# Altium project ChiptunePlayer-2.22-MainBoard v2.0.PrjPCB
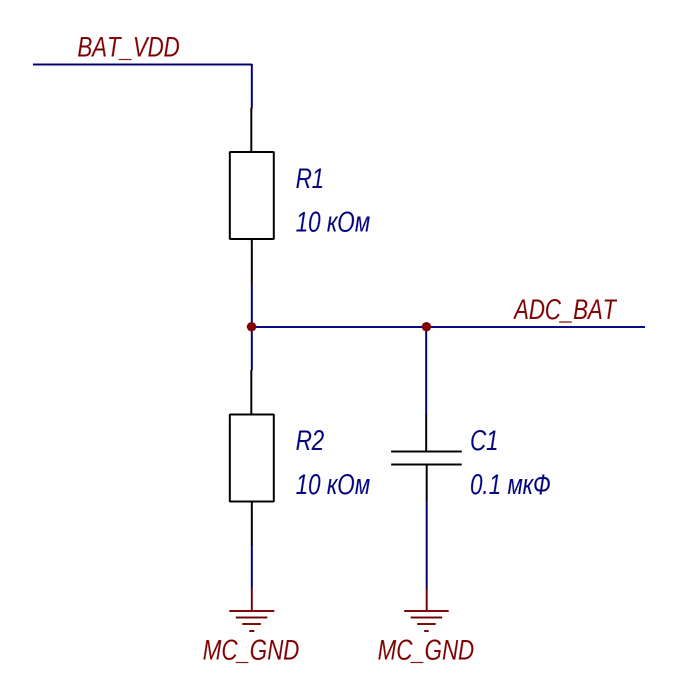
[diagram p0: BatteryCheck.SchDoc]
10 sheets, 91 parts. Net scope: global (net labels, ports and power ports of the same name join across sheets).
Board file: main.PcbDoc
Sheets:
  BatteryCheck.SchDoc
  Connectors.SchDoc
  ControlledCharger.SchDoc
  Microcontroller.SchDoc
  PowerManagement.SchDoc
  DcDc3V3.SchDoc
  DcDc5V.SchDoc
  MicroSdCard.SchDoc
  KeyBoard.SchDoc
  Lcd.SchDoc

## Sheet BatteryCheck.SchDoc
size 420 x 297 mm; DocumentNumber: BatteryCheck

### Parts
C1  0.1 мкФ  [C 0805]
R1  10 кОм  [RES 0402]
R2  10 кОм  [RES 0402]

### Nets
MC_GND: C1.2 R2.1
ADC_BAT: C1.1 R1.1 R2.2
BAT_VDD: R1.2

### Notes on the sheet
- Подп. и дата
- Инв. № дубл.
- Взам. инв. №
- Инв. № подл.
- Лист
- Изм.
- № докум.
- Подп.
- Дата
- Копировал
- Формат А3

### Library data of the parts
C1 = CAP 0805: SMD Capacitor 0805; Manufacturer: /Укажите компанию-производителя/; Tolerance: /Укажите допуск в процентах/; Temperature coefficient: /Формат: ±? ppm/°C/; Type: Конденсатор керамический; TC: /Укажите тип диэлектрика/; Size: 0805; Temperature range: /Формат: -? ... ? °C/
R1 R2 = RES 0402

## Sheet Connectors.SchDoc
size 420 x 297 mm; DocumentNumber: Connectors
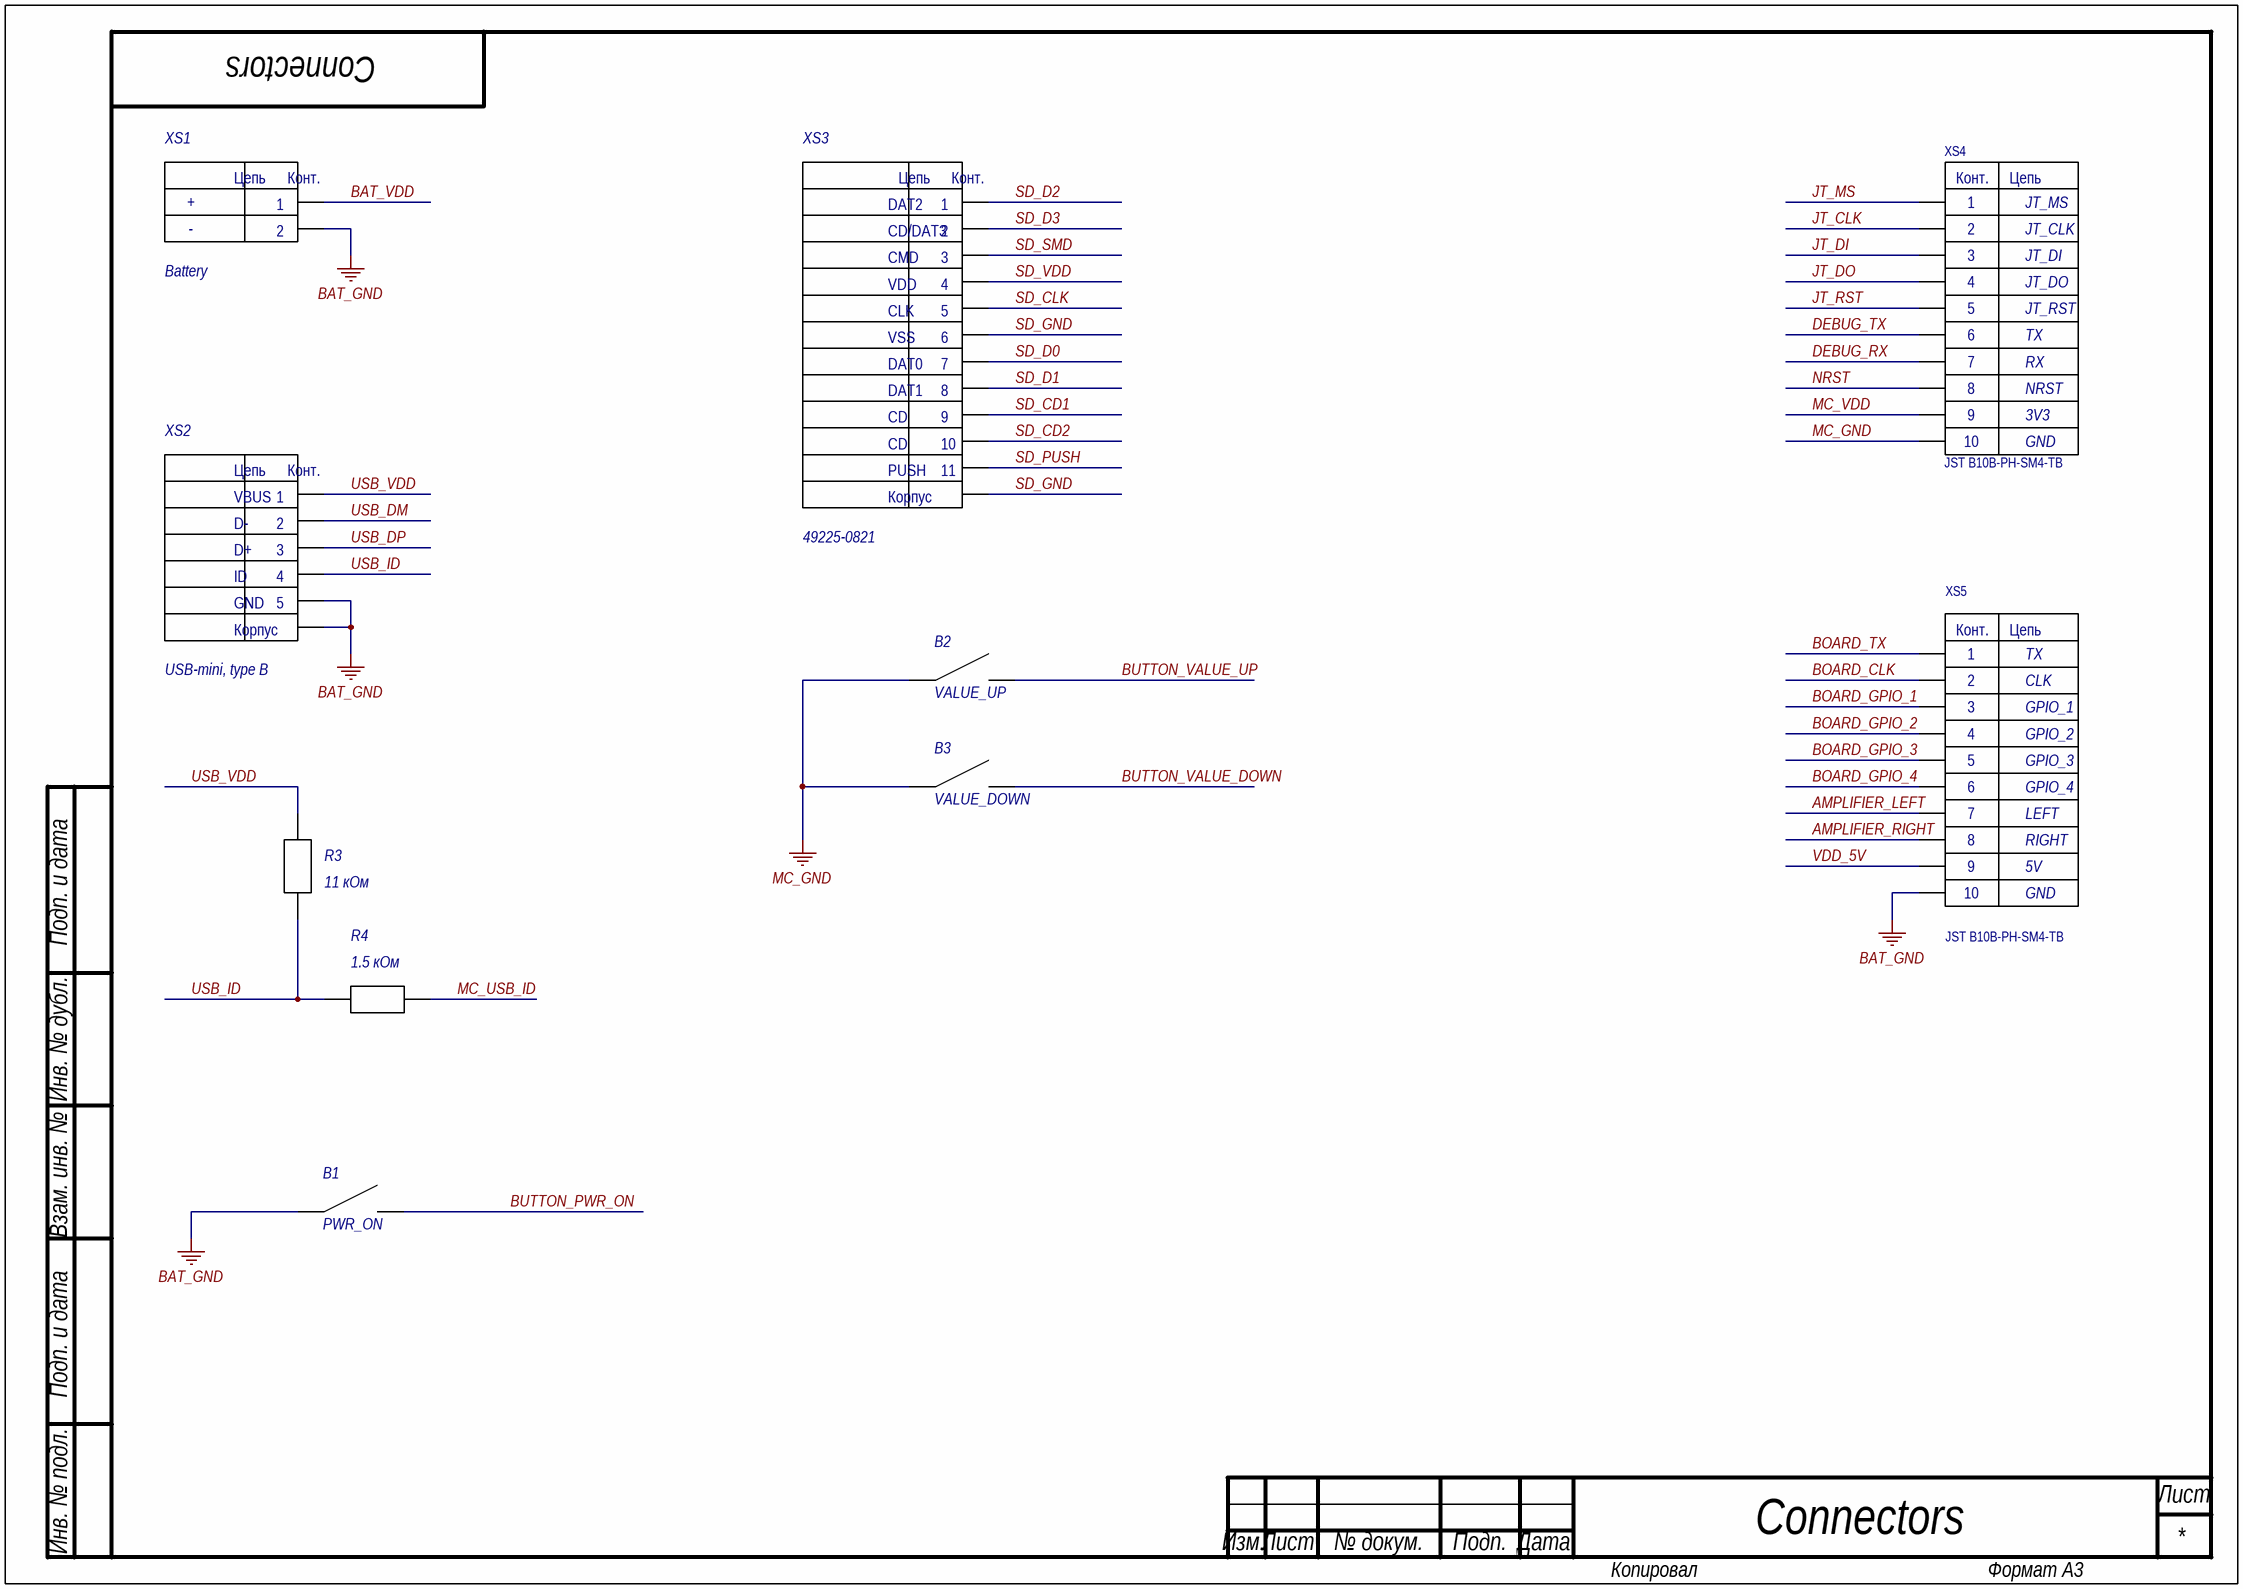
[diagram p1: Connectors.SchDoc]

### Parts
B1  PWR_ON  [TACT SKHH Horizontal Switch]
B2  VALUE_UP  [TACT SKHH Horizontal Switch]
B3  VALUE_DOWN  [TACT SKHH Horizontal Switch]
R3  11 кОм  [RES 0402]
R4  1.5 кОм  [RES 0402]
XS1  Battery  [JST B2B-PH-SM4-TB]
XS2  USB-mini, type B  [USB_mini_B]
XS3  49225-0821  [MOLEX 49225-0821]
XS4  JST B10B-PH-SM4-TB  [B10B-PH-SM4-TB]
XS5  JST B10B-PH-SM4-TB  [B10B-PH-SM4-TB]

### Nets
BAT_GND: B1.1 XS1.2 XS2.0 XS2.5(GND) XS5.10
MC_GND: B2.1 B3.1 XS4.10
MC_VDD: XS4.9
AMPLIFIER_LEFT: XS5.7
AMPLIFIER_RIGHT: XS5.8
BAT_VDD: XS1.1
BOARD_CLK: XS5.2
BOARD_GPIO_1: XS5.3
BOARD_GPIO_2: XS5.4
BOARD_GPIO_3: XS5.5
BOARD_GPIO_4: XS5.6
BOARD_TX: XS5.1
BUTTON_PWR_ON: B1.2
BUTTON_VALUE_DOWN: B3.2
BUTTON_VALUE_UP: B2.2
DEBUG_RX: XS4.7
DEBUG_TX: XS4.6
JT_CLK: XS4.2
JT_DI: XS4.3
JT_DO: XS4.4
JT_MS: XS4.1
JT_RST: XS4.5
MC_USB_ID: R4.1
NRST: XS4.8
SD_CD1: XS3.9
SD_CD2: XS3.10
SD_CLK: XS3.5
SD_D0: XS3.7
SD_D1: XS3.8
SD_D2: XS3.1
SD_D3: XS3.2
SD_GND: XS3.0 XS3.6
SD_PUSH: XS3.11
SD_SMD: XS3.3
SD_VDD: XS3.4
USB_DM: XS2.2(D-)
USB_DP: XS2.3(D+)
USB_ID: R3.1 R4.2 XS2.4(CASE)
USB_VDD: R3.2 XS2.1(VBUS)
VDD_5V: XS5.9

### Notes on the sheet
- +
- -
- JT_CLK
- JT_MS
- JT_DI
- JT_RST
- JT_DO
- TX
- NRST
- RX
- 3V3
- GND
- CLK
- GPIO_1
- GPIO_2
- GPIO_3
- GPIO_4
- LEFT
- RIGHT
- 5V
- Подп. и дата
- Инв. № дубл.
- Взам. инв. №
- Инв. № подл.
- Лист
- Изм.
- № докум.
- Подп.
- Дата
- Копировал
- Формат А3
- (in symbol 49225-0821) Цепь; Конт.; DAT2; CD/DAT3; CMD; VDD; CLK; VSS; DAT0; DAT1; CD; PUSH; Корпус
- (in symbol JST B2B-PH-SM4-TB) Цепь; Конт.
- (in symbol JST B10B-PH-SM4-TB) Конт.; Цепь
- (in symbol USB-mini_B) Цепь; Конт.; ID; Корпус

### Library data of the parts
B1-B3 = BUTTON
R3 R4 = RES 0402
XS1 = JST B2B-PH-SM4-TB
XS2 = USB-mini_B: USB-mini-B connector; Manufacturer: NONAME; Connector type: USB-mini, тип B на плату; Number of contacts: 5; Type: Разъем
XS3 = 49225-0821: MOLEX MicroSD connector; Connector type: Разъем MicroSD на плату; Number of contacts: 11; Manufacturer: Molex; Type: Разъем
XS4 XS5 = JST B10B-PH-SM4-TB: PLS connector; Manufacturer: NONAME; Connector type: Вилка на плату; Number of contacts: 10; Type: Разъем штыревой

## Sheet ControlledCharger.SchDoc
size 420 x 297 mm; DocumentNumber: ControlledCharger
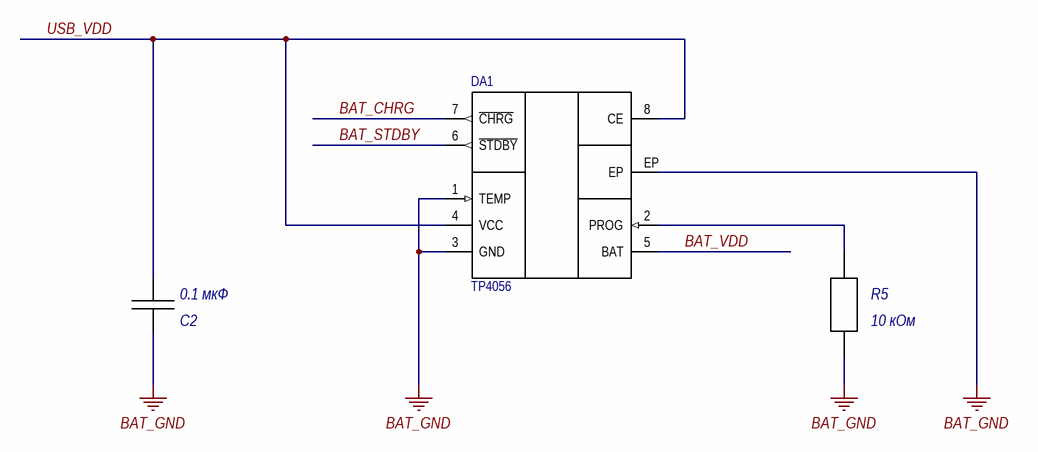
[diagram p2: ControlledCharger.SchDoc]

### Parts
C2  0.1 мкФ  [C 0805]
DA1  TP4056  [HSOP-8]
R5  10 кОм  [RES 0402]

### Nets
BAT_GND: C2.2 DA1.1(TEMP) DA1.3(GND) DA1.EP R5.1
BAT_CHRG: DA1.7(~{CHRG})
BAT_STDBY: DA1.6(~{STDBY})
BAT_VDD: DA1.5(BAT)
USB_VDD: C2.1 DA1.4(VCC) DA1.8(CE)
NetDA1_2: DA1.2(PROG) R5.2

### Notes on the sheet
- Подп. и дата
- Инв. № дубл.
- Взам. инв. №
- Инв. № подл.
- Лист
- Изм.
- № докум.
- Подп.
- Дата
- Копировал
- Формат А3

### Library data of the parts
C2 = CAP 0805: as C1 on sheet BatteryCheck; Size: 0805; Temperature range: /Формат: -? ... ? °C/
R5 = RES 0402

## Sheet Microcontroller.SchDoc
size 420 x 297 mm; DocumentNumber: Microcontroller
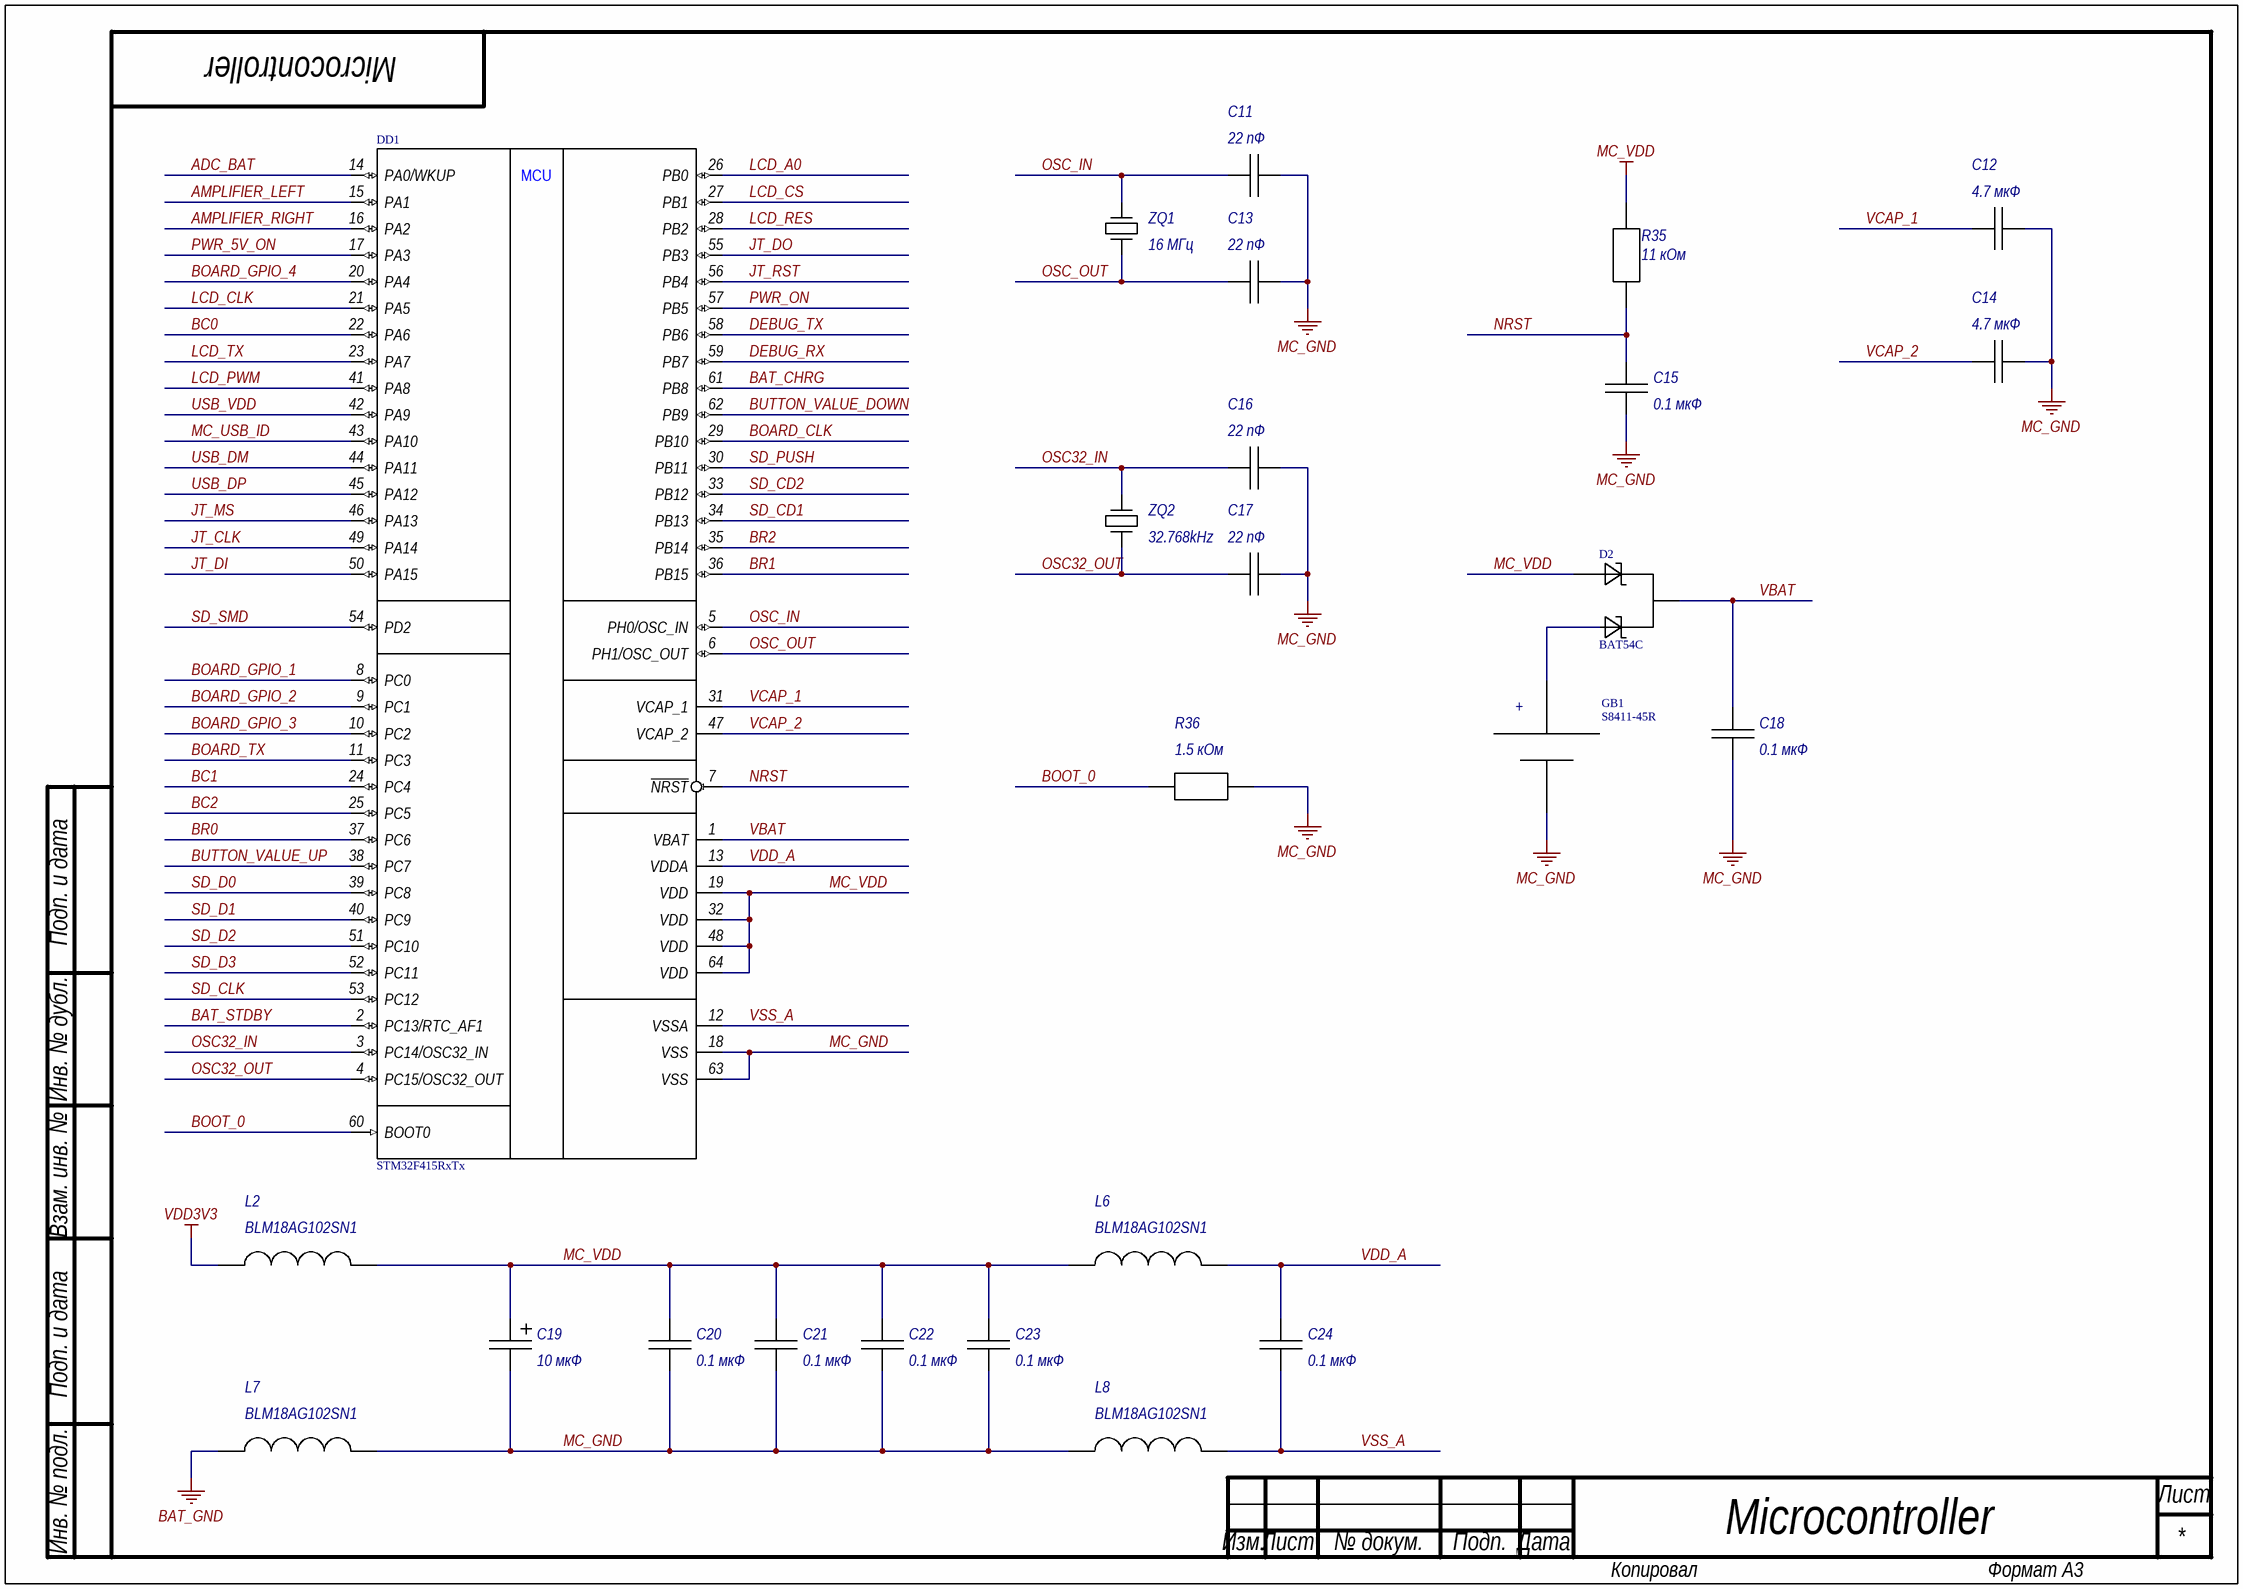
[diagram p3: Microcontroller.SchDoc]

### Parts
C11  22 пФ  [C 0805]
C12  4.7 мкФ  [C 0805]
C13  22 пФ  [C 0805]
C14  4.7 мкФ  [C 0805]
C15  0.1 мкФ  [C 0805]
C16  22 пФ  [C 0805]
C17  22 пФ  [C 0805]
C18  0.1 мкФ  [C 0805]
C19  10 мкФ  [C TAN_A]
C20  0.1 мкФ  [C 0805]
C21  0.1 мкФ  [C 0805]
C22  0.1 мкФ  [C 0805]
C23  0.1 мкФ  [C 0805]
C24  0.1 мкФ  [C 0805]
D2  BAT54C  [SOT-23]
DD1  STM32F415RxTx  [LQFP64]
GB1  S8411-45R  [S8411-45R]
L2  BLM18AG102SN1  [FB 0603]
L6  BLM18AG102SN1  [FB 0603]
L7  BLM18AG102SN1  [FB 0603]
L8  BLM18AG102SN1  [FB 0603]
R35  11 кОм  [RES 0402]
R36  1.5 кОм  [RES 0402]
ZQ1  value 16 МГц  [NX3225SA]  (hidden comment: NX3225SA-16.000M-STD-CRS-2)
ZQ2  value 32.768kHz  [MC-306]  (hidden comment: MC-306)

### Nets
BAT_GND: L7.1
MC_GND: C11.2 C12.2 C13.2 C14.2 C15.1 C16.2 C17.2 C18.2 C19.2 C20.2 C21.2 C22.2 C23.2 DD1.18(VSS) DD1.63(VSS) GB1.2 L7.2 L8.1 R36.1
MC_VDD: C19.1 C20.1 C21.1 C22.1 C23.1 D2.2 DD1.19(VDD) DD1.32(VDD) DD1.48(VDD) DD1.64(VDD) L2.2 L6.1 R35.1
VDD3V3: L2.1
ADC_BAT: DD1.14(PA0/WKUP)
AMPLIFIER_LEFT: DD1.15(PA1)
AMPLIFIER_RIGHT: DD1.16(PA2)
BAT_CHRG: DD1.61(PB8)
BAT_STDBY: DD1.2(PC13/RTC_AF1)
BC0: DD1.22(PA6)
BC1: DD1.24(PC4)
BC2: DD1.25(PC5)
BOARD_CLK: DD1.29(PB10)
BOARD_GPIO_1: DD1.8(PC0)
BOARD_GPIO_2: DD1.9(PC1)
BOARD_GPIO_3: DD1.10(PC2)
BOARD_GPIO_4: DD1.20(PA4)
BOARD_TX: DD1.11(PC3)
BOOT_0: DD1.60(BOOT0) R36.2
BR0: DD1.37(PC6)
BR1: DD1.36(PB15)
BR2: DD1.35(PB14)
BUTTON_VALUE_DOWN: DD1.62(PB9)
BUTTON_VALUE_UP: DD1.38(PC7)
DEBUG_RX: DD1.59(PB7)
DEBUG_TX: DD1.58(PB6)
JT_CLK: DD1.49(PA14)
JT_DI: DD1.50(PA15)
JT_DO: DD1.55(PB3)
JT_MS: DD1.46(PA13)
JT_RST: DD1.56(PB4)
LCD_A0: DD1.26(PB0)
LCD_CLK: DD1.21(PA5)
LCD_CS: DD1.27(PB1)
LCD_PWM: DD1.41(PA8)
LCD_RES: DD1.28(PB2)
LCD_TX: DD1.23(PA7)
MC_USB_ID: DD1.43(PA10)
NRST: C15.2 DD1.7(~{NRST}) R35.2
OSC32_IN: C16.1 DD1.3(PC14/OSC32_IN) ZQ2.4(NC)
OSC32_OUT: C17.1 DD1.4(PC15/OSC32_OUT) ZQ2.1(XI)
OSC_IN: C11.1 DD1.5(PH0/OSC_IN) ZQ1.3(XO)
OSC_OUT: C13.1 DD1.6(PH1/OSC_OUT) ZQ1.1(XI)
PWR_5V_ON: DD1.17(PA3)
PWR_ON: DD1.57(PB5)
SD_CD1: DD1.34(PB13)
SD_CD2: DD1.33(PB12)
SD_CLK: DD1.53(PC12)
SD_D0: DD1.39(PC8)
SD_D1: DD1.40(PC9)
SD_D2: DD1.51(PC10)
SD_D3: DD1.52(PC11)
SD_PUSH: DD1.30(PB11)
SD_SMD: DD1.54(PD2)
USB_DM: DD1.44(PA11)
USB_DP: DD1.45(PA12)
USB_VDD: DD1.42(PA9)
VBAT: C18.1 D2.3 DD1.1(VBAT)
VCAP_1: C12.1 DD1.31(VCAP_1)
VCAP_2: C14.1 DD1.47(VCAP_2)
VDD_A: C24.1 DD1.13(VDDA) L6.2
VSS_A: C24.2 DD1.12(VSSA) L8.2
NetD2_1: D2.1 GB1.1

Not connected (* = marked no-connect by the designer): ZQ1 2(NC) 4(NC); ZQ2 2(NC)

### Notes on the sheet
- Подп. и дата
- Инв. № дубл.
- Взам. инв. №
- Инв. № подл.
- Лист
- Изм.
- № докум.
- Подп.
- Дата
- Копировал
- Формат А3
- (in symbol S8411-45R) +
- (in symbol STM32F415RxTx) MCU

### Library data of the parts
C11-C18 C20-C24 = CAP 0805: as C1 on sheet BatteryCheck; Size: 0805; Temperature range: /Формат: -? ... ? °C/
C19 = CAP TAN_A: SMD Tantalium Capacitor A; Type: Конденсатор танталовый; Rated voltage: 16; Size: A
R35 R36 = RES 0402
ZQ1 = NX3225SA-16.000M-STD-CRS-2: QUARTZ CRYSTAL; Manufacturer: NDK; Load capacitance: 8 пФ; Frequency stability: ±15 ppm; Type: Кварцевый резонатор; Temperature range: -40 ... 125 °C
ZQ2 = MC-306: QUARTZ CRYSTAL; Type: Кварцевый резонатор

## Sheet PowerManagement.SchDoc
size 420 x 297 mm; DocumentNumber: PowerManagement
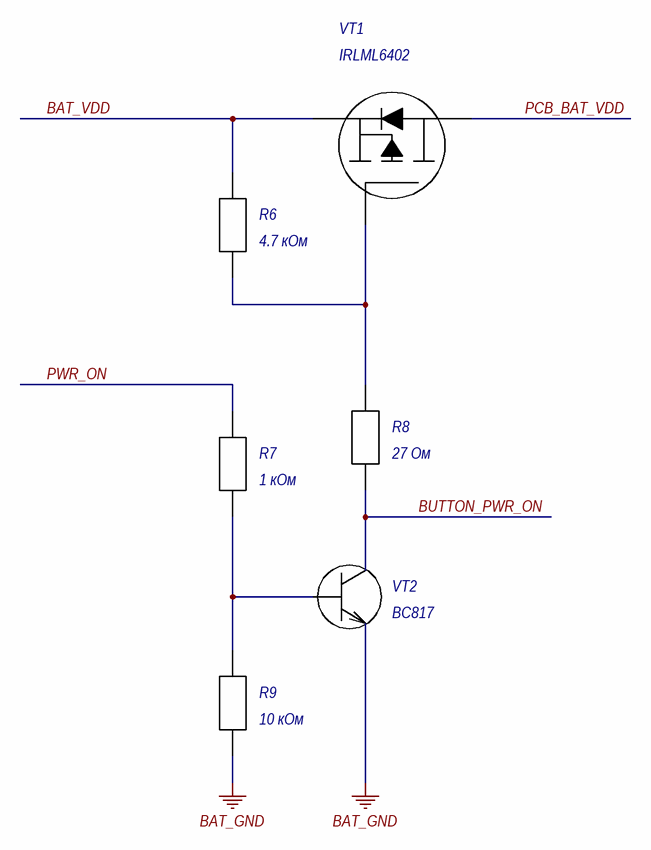
[diagram p4: PowerManagement.SchDoc]

### Parts
R6  4.7 кОм  [RES 0402]
R7  1 кОм  [RES 0402]
R8  27 Ом  [RES 0402]
R9  10 кОм  [RES 0402]
VT1  IRLML6402  [SOT-23]
VT2  BC817  [SOT-23]

### Nets
BAT_GND: R9.1 VT2.2(E)
BAT_VDD: R6.2 VT1.2(S)
BUTTON_PWR_ON: R8.1 VT2.3(C)
PCB_BAT_VDD: VT1.3(D)
PWR_ON: R7.2
NetR6_1: R6.1 R8.2 VT1.1(G)
NetR7_1: R7.1 R9.2 VT2.1(B)

### Notes on the sheet
- Подп. и дата
- Инв. № дубл.
- Взам. инв. №
- Инв. № подл.
- Лист
- Изм.
- № докум.
- Подп.
- Дата
- Копировал
- Формат А3

### Library data of the parts
R6-R9 = RES 0402
VT2 = BC817: NPN general-purpose transistor; Manufacturer: NXP; Structure: n-p-n; Type: Транзистор биполярный; hFE: 160 ... 600; Max collector-emitter voltage: 45 В; Max collector-base voltage: 50 В; Max emitter-base voltage: 5 В; Max collector current: 0,5 А; Max collector peak current: 1 А; Power dissitipation: 0,25 Вт; fT: 100 МГц; Collector-emitter saturation voltage: 0,7 В; Base-emitter on voltage: 1,2 В; Specitication: ЭКБ ИП; Collector-base сapacitance: 3 пФ; Complement: BC807; Temperature range: -65 ... 150 °C

## Sheet DcDc3V3.SchDoc
size 420 x 297 mm; DocumentNumber: DcDc3V3
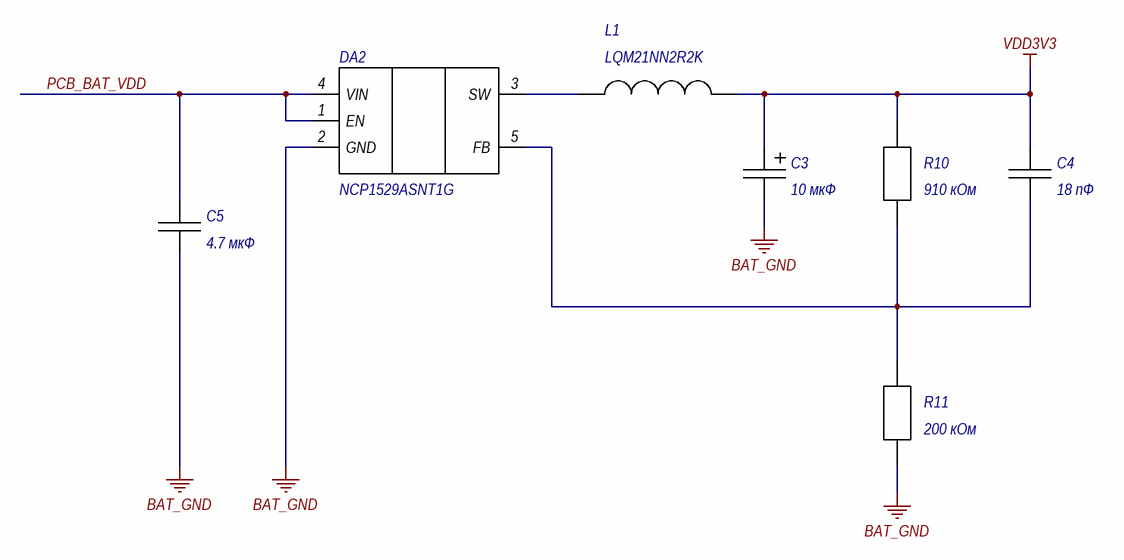
[diagram p5: DcDc3V3.SchDoc]

### Parts
C3  10 мкФ  [C TAN_A]
C4  18 пФ  [C 0805]
C5  4.7 мкФ  [C 0805]
DA2  NCP1529ASNT1G  [TSOP-5]
L1  LQM21NN2R2K  [LQM21N]
R10  910 кОм  [RES 0402]
R11  200 кОм  [RES 0402]

### Nets
BAT_GND: C3.2 C5.2 DA2.2(GND) R11.2
VDD3V3: C3.1 C4.1 L1.2 R10.2
PCB_BAT_VDD: C5.1 DA2.1(EN) DA2.4(VIN)
NetC4_2: C4.2 DA2.5(FB) R10.1 R11.1
NetDA2_3: DA2.3(SW) L1.1

### Notes on the sheet
- Подп. и дата
- Инв. № дубл.
- Взам. инв. №
- Инв. № подл.
- Лист
- Изм.
- № докум.
- Подп.
- Дата
- Копировал
- Формат А3

### Library data of the parts
C3 = CAP TAN_A: as C19 on sheet Microcontroller; Size: A
C4 C5 = CAP 0805: as C1 on sheet BatteryCheck; Size: 0805; Temperature range: /Формат: -? ... ? °C/
R10 R11 = RES 0402

## Sheet DcDc5V.SchDoc
size 420 x 297 mm; DocumentNumber: DcDc5V
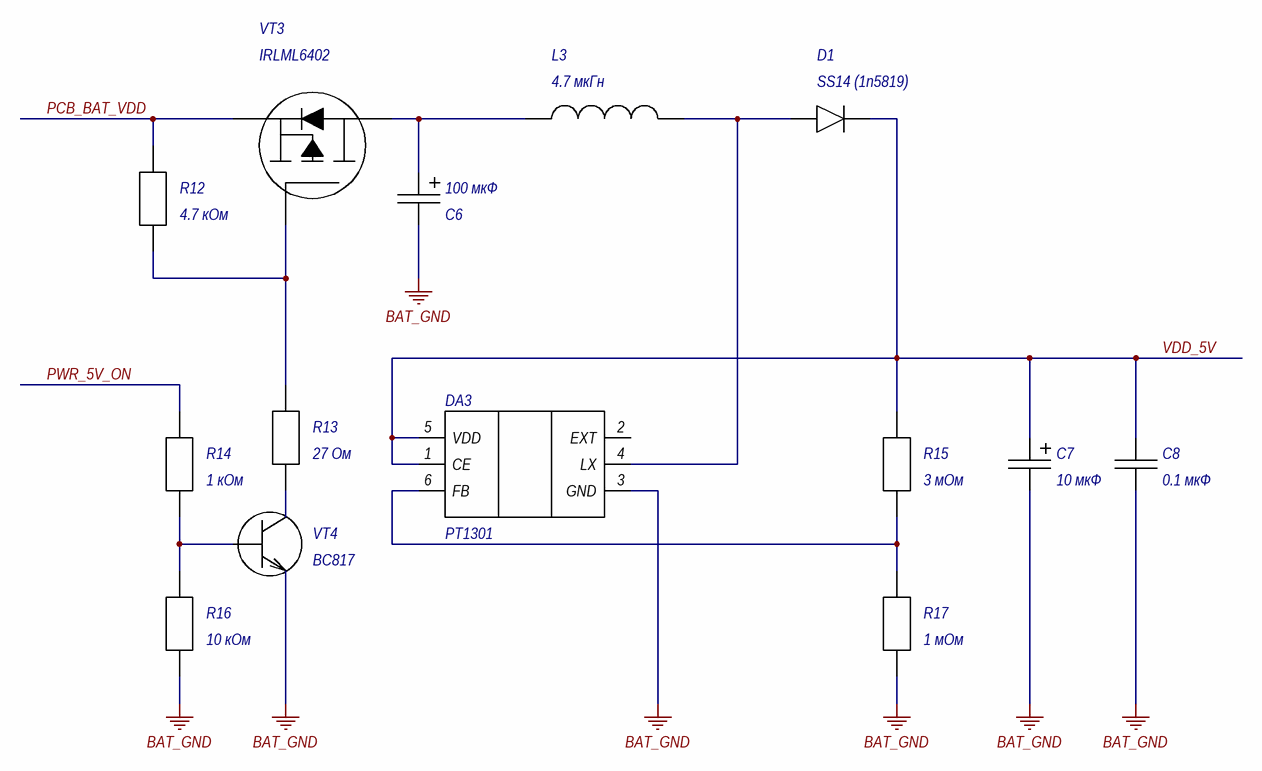
[diagram p6: DcDc5V.SchDoc]

### Parts
C6  100 мкФ  [C TAN_C]
C7  10 мкФ  [C TAN_A]
C8  0.1 мкФ  [C 0805]
D1  SS14 (1n5819)  [SMA/DO-214AC]
DA3  PT1301  [SOT-23-6]
L3  4.7 мкГн  [CD43]
R12  4.7 кОм  [RES 0402]
R13  27 Ом  [RES 0402]
R14  1 кОм  [RES 0402]
R15  3 мОм  [RES 0402]
R16  10 кОм  [RES 0402]
R17  1 мОм  [RES 0402]
VT3  IRLML6402  [SOT-23]
VT4  BC817  [SOT-23]

### Nets
BAT_GND: C6.2 C7.2 C8.2 DA3.3(GND) R16.1 R17.1 VT4.2(E)
PCB_BAT_VDD: R12.2 VT3.2(S)
PWR_5V_ON: R14.2
VDD_5V: C7.1 C8.1 D1.C DA3.1(CE) DA3.5(VDD) R15.2
NetC6_1: C6.1 L3.1 VT3.3(D)
NetD1_A: D1.A DA3.4(LX) L3.2
NetDA3_6: DA3.6(FB) R15.1 R17.2
NetR12_1: R12.1 R13.2 VT3.1(G)
NetR13_1: R13.1 VT4.3(C)
NetR14_1: R14.1 R16.2 VT4.1(B)

Not connected (* = marked no-connect by the designer): DA3 2(EXT)

### Notes on the sheet
- Подп. и дата
- Инв. № дубл.
- Взам. инв. №
- Инв. № подл.
- Лист
- Изм.
- № докум.
- Подп.
- Дата
- Копировал
- Формат А3

### Library data of the parts
C6 = CAP TAN_C: SMD Tantalium Capacitor C; Type: Конденсатор танталовый; Size: C
C7 = CAP TAN_A: SMD Tantalium Capacitor A; Type: Конденсатор танталовый; Rated voltage: 10 В; Size: A
C8 = CAP 0805: as C1 on sheet BatteryCheck; Size: 0805; Temperature range: /Формат: -? ... ? °C/
D1 = D SS14 (1n5819)
DA3 = PT1301: DC-DC step-up (повышающий) PT1301 в корпусе SOT23-6.
L3 = L 4.7 uH: Катушка индуктивности 4.7 мкГн корпус CD43 (индуктивность 4.7 uH).
R12-R17 = RES 0402
VT4 = BC817: as VT2 on sheet PowerManagement; Temperature range: -65 ... 150 °C

## Sheet MicroSdCard.SchDoc
size 420 x 297 mm; DocumentNumber: MicroSdCard
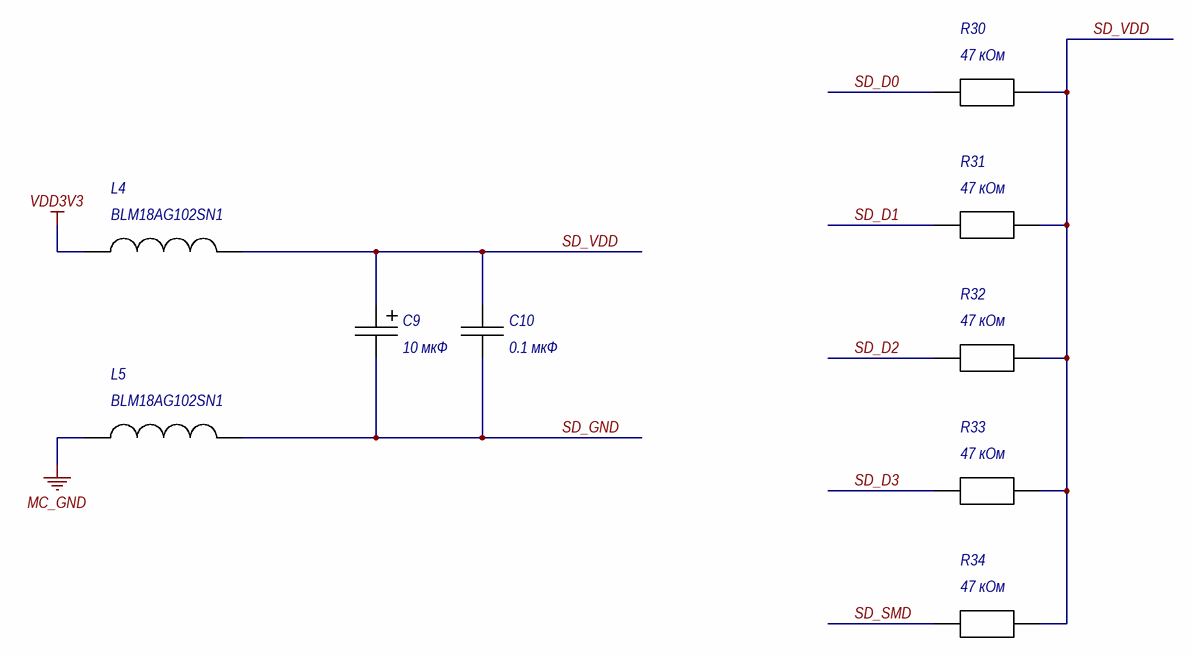
[diagram p7: MicroSdCard.SchDoc]

### Parts
C9  10 мкФ  [C TAN_A]
C10  0.1 мкФ  [C 0805]
L4  BLM18AG102SN1  [FB 0603]
L5  BLM18AG102SN1  [FB 0603]
R30  47 кОм  [RES 0402]
R31  47 кОм  [RES 0402]
R32  47 кОм  [RES 0402]
R33  47 кОм  [RES 0402]
R34  47 кОм  [RES 0402]

### Nets
MC_GND: L5.1
VDD3V3: L4.1
SD_D0: R30.2
SD_D1: R31.2
SD_D2: R32.2
SD_D3: R33.2
SD_GND: C9.2 C10.2 L5.2
SD_SMD: R34.2
SD_VDD: C9.1 C10.1 L4.2 R30.1 R31.1 R32.1 R33.1 R34.1

### Notes on the sheet
- Подп. и дата
- Инв. № дубл.
- Взам. инв. №
- Инв. № подл.
- Лист
- Изм.
- № докум.
- Подп.
- Дата
- Копировал
- Формат А3

### Library data of the parts
C9 = CAP TAN_A: as C19 on sheet Microcontroller; Size: A
C10 = CAP 0805: as C1 on sheet BatteryCheck; Size: 0805; Temperature range: /Формат: -? ... ? °C/
R30-R34 = RES 0402

## Sheet KeyBoard.SchDoc
size 420 x 297 mm; DocumentNumber: KeyBoard
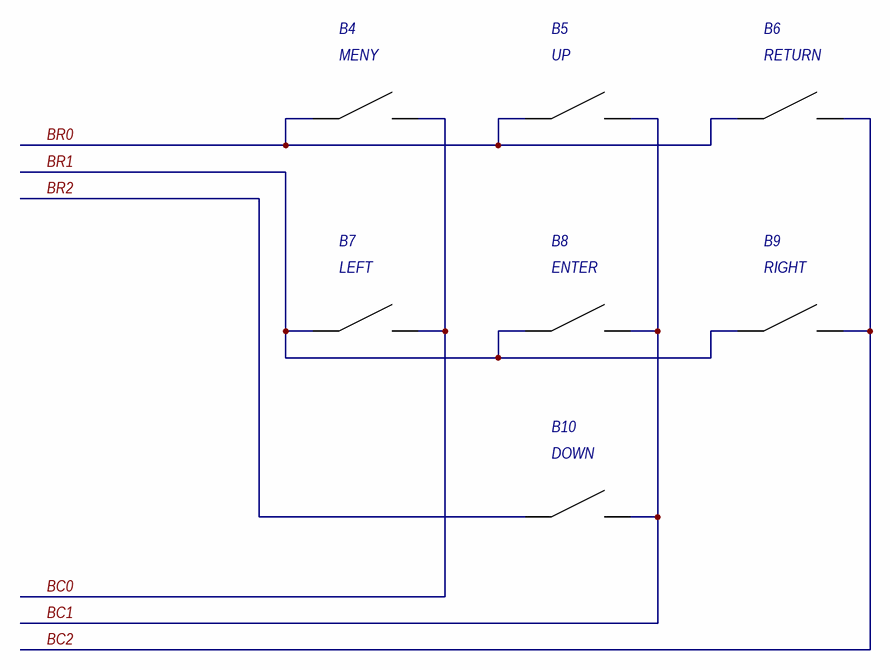
[diagram p8: KeyBoard.SchDoc]

### Parts
B4  MENY  [BUTTON_DIP]
B5  UP  [BUTTON_DIP]
B6  RETURN  [BUTTON_DIP]
B7  LEFT  [BUTTON_DIP]
B8  ENTER  [BUTTON_DIP]
B9  RIGHT  [BUTTON_DIP]
B10  DOWN  [BUTTON_DIP]

### Nets
BC0: B4.2 B7.2
BC1: B5.2 B8.2 B10.2
BC2: B6.2 B9.2
BR0: B4.1 B5.1 B6.1
BR1: B7.1 B8.1 B9.1
BR2: B10.1

### Notes on the sheet
- Подп. и дата
- Инв. № дубл.
- Взам. инв. №
- Инв. № подл.
- Лист
- Изм.
- № докум.
- Подп.
- Дата
- Копировал
- Формат А3

### Library data of the parts
B4-B10 = BUTTON

## Sheet Lcd.SchDoc
size 420 x 297 mm; DocumentNumber: Lcd
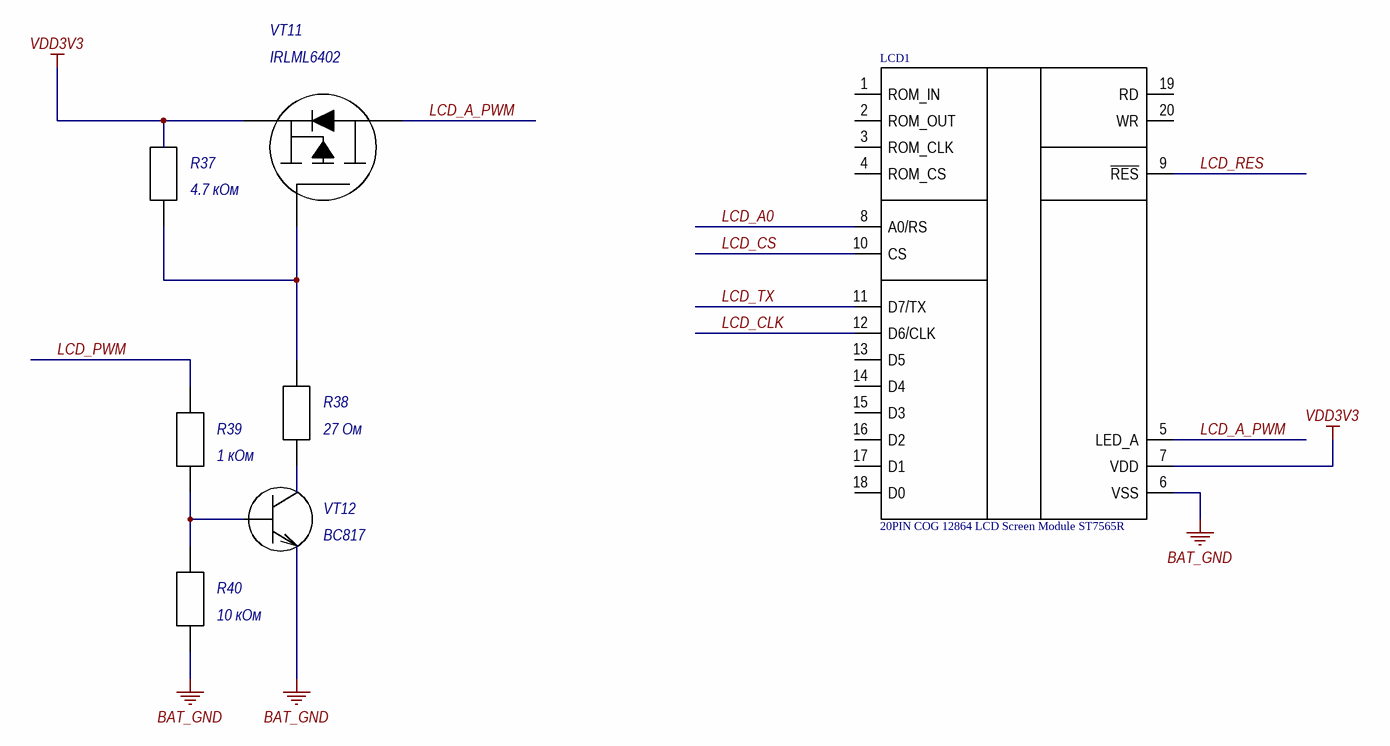
[diagram p9: Lcd.SchDoc]

### Parts
LCD1  20PIN COG 12864 LCD Screen Module ST7565R  [COG 12864 LCD Screen Module ST7565R]
R37  4.7 кОм  [RES 0402]
R38  27 Ом  [RES 0402]
R39  1 кОм  [RES 0402]
R40  10 кОм  [RES 0402]
VT11  IRLML6402  [SOT-23]
VT12  BC817  [SOT-23]

### Nets
BAT_GND: LCD1.6(VSS) R40.1 VT12.2(E)
VDD3V3: LCD1.7(VDD) R37.2 VT11.2(S)
LCD_A0: LCD1.8(A0/RS)
LCD_A_PWM: LCD1.5(LED_A) VT11.3(D)
LCD_CLK: LCD1.12(D6/CLK)
LCD_CS: LCD1.10(CS)
LCD_PWM: R39.2
LCD_RES: LCD1.9(~{RES})
LCD_TX: LCD1.11(D7/TX)
NetR37_1: R37.1 R38.2 VT11.1(G)
NetR38_1: R38.1 VT12.3(C)
NetR39_1: R39.1 R40.2 VT12.1(B)

Not connected (* = marked no-connect by the designer): LCD1 1(ROM_IN) 2(ROM_OUT) 3(ROM_CLK) 4(ROM_CS) 13(D5) 14(D4) 15(D3) 16(D2) 17(D1) 18(D0) 19(RD) 20(WR)

### Notes on the sheet
- Подп. и дата
- Инв. № дубл.
- Взам. инв. №
- Инв. № подл.
- Лист
- Изм.
- № докум.
- Подп.
- Дата
- Копировал
- Формат А3

### Library data of the parts
R37-R40 = RES 0402
VT12 = BC817: as VT2 on sheet PowerManagement; Temperature range: -65 ... 150 °C

## Nets that join several sheets
BAT_GND: Connectors (5 pins), ControlledCharger (5 pins), Microcontroller (L7.1), PowerManagement (R9.1 VT2.2), DcDc3V3 (C3.2 C5.2 DA2.2 R11.2), DcDc5V (7 pins), Lcd (LCD1.6 R40.1 VT12.2)
MC_GND: BatteryCheck (C1.2 R2.1), Connectors (B2.1 B3.1 XS4.10), Microcontroller (19 pins), MicroSdCard (L5.1)
MC_VDD: Connectors (XS4.9), Microcontroller (13 pins)
VDD3V3: Microcontroller (L2.1), DcDc3V3 (C3.1 C4.1 L1.2 R10.2), MicroSdCard (L4.1), Lcd (LCD1.7 R37.2 VT11.2)
ADC_BAT: BatteryCheck (C1.1 R1.1 R2.2), Microcontroller (DD1.14)
AMPLIFIER_LEFT: Connectors (XS5.7), Microcontroller (DD1.15)
AMPLIFIER_RIGHT: Connectors (XS5.8), Microcontroller (DD1.16)
BAT_CHRG: ControlledCharger (DA1.7), Microcontroller (DD1.61)
BAT_STDBY: ControlledCharger (DA1.6), Microcontroller (DD1.2)
BAT_VDD: BatteryCheck (R1.2), Connectors (XS1.1), ControlledCharger (DA1.5), PowerManagement (R6.2 VT1.2)
BC0: Microcontroller (DD1.22), KeyBoard (B4.2 B7.2)
BC1: Microcontroller (DD1.24), KeyBoard (B5.2 B8.2 B10.2)
BC2: Microcontroller (DD1.25), KeyBoard (B6.2 B9.2)
BOARD_CLK: Connectors (XS5.2), Microcontroller (DD1.29)
BOARD_GPIO_1: Connectors (XS5.3), Microcontroller (DD1.8)
BOARD_GPIO_2: Connectors (XS5.4), Microcontroller (DD1.9)
BOARD_GPIO_3: Connectors (XS5.5), Microcontroller (DD1.10)
BOARD_GPIO_4: Connectors (XS5.6), Microcontroller (DD1.20)
BOARD_TX: Connectors (XS5.1), Microcontroller (DD1.11)
BR0: Microcontroller (DD1.37), KeyBoard (B4.1 B5.1 B6.1)
BR1: Microcontroller (DD1.36), KeyBoard (B7.1 B8.1 B9.1)
BR2: Microcontroller (DD1.35), KeyBoard (B10.1)
BUTTON_PWR_ON: Connectors (B1.2), PowerManagement (R8.1 VT2.3)
BUTTON_VALUE_DOWN: Connectors (B3.2), Microcontroller (DD1.62)
BUTTON_VALUE_UP: Connectors (B2.2), Microcontroller (DD1.38)
DEBUG_RX: Connectors (XS4.7), Microcontroller (DD1.59)
DEBUG_TX: Connectors (XS4.6), Microcontroller (DD1.58)
JT_CLK: Connectors (XS4.2), Microcontroller (DD1.49)
JT_DI: Connectors (XS4.3), Microcontroller (DD1.50)
JT_DO: Connectors (XS4.4), Microcontroller (DD1.55)
JT_MS: Connectors (XS4.1), Microcontroller (DD1.46)
JT_RST: Connectors (XS4.5), Microcontroller (DD1.56)
LCD_A0: Microcontroller (DD1.26), Lcd (LCD1.8)
LCD_CLK: Microcontroller (DD1.21), Lcd (LCD1.12)
LCD_CS: Microcontroller (DD1.27), Lcd (LCD1.10)
LCD_PWM: Microcontroller (DD1.41), Lcd (R39.2)
LCD_RES: Microcontroller (DD1.28), Lcd (LCD1.9)
LCD_TX: Microcontroller (DD1.23), Lcd (LCD1.11)
MC_USB_ID: Connectors (R4.1), Microcontroller (DD1.43)
NRST: Connectors (XS4.8), Microcontroller (C15.2 DD1.7 R35.2)
PCB_BAT_VDD: PowerManagement (VT1.3), DcDc3V3 (C5.1 DA2.1 DA2.4), DcDc5V (R12.2 VT3.2)
PWR_5V_ON: Microcontroller (DD1.17), DcDc5V (R14.2)
PWR_ON: Microcontroller (DD1.57), PowerManagement (R7.2)
SD_CD1: Connectors (XS3.9), Microcontroller (DD1.34)
SD_CD2: Connectors (XS3.10), Microcontroller (DD1.33)
SD_CLK: Connectors (XS3.5), Microcontroller (DD1.53)
SD_D0: Connectors (XS3.7), Microcontroller (DD1.39), MicroSdCard (R30.2)
SD_D1: Connectors (XS3.8), Microcontroller (DD1.40), MicroSdCard (R31.2)
SD_D2: Connectors (XS3.1), Microcontroller (DD1.51), MicroSdCard (R32.2)
SD_D3: Connectors (XS3.2), Microcontroller (DD1.52), MicroSdCard (R33.2)
SD_GND: Connectors (XS3.0 XS3.6), MicroSdCard (C9.2 C10.2 L5.2)
SD_PUSH: Connectors (XS3.11), Microcontroller (DD1.30)
SD_SMD: Connectors (XS3.3), Microcontroller (DD1.54), MicroSdCard (R34.2)
SD_VDD: Connectors (XS3.4), MicroSdCard (8 pins)
USB_DM: Connectors (XS2.2), Microcontroller (DD1.44)
USB_DP: Connectors (XS2.3), Microcontroller (DD1.45)
USB_VDD: Connectors (R3.2 XS2.1), ControlledCharger (C2.1 DA1.4 DA1.8), Microcontroller (DD1.42)
VDD_5V: Connectors (XS5.9), DcDc5V (6 pins)